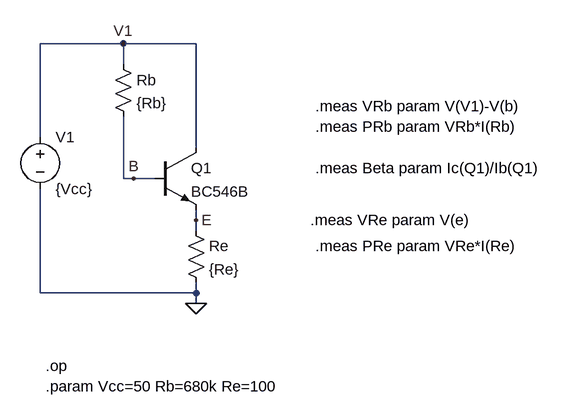
[diagram p0: schematic TBJ03a.asc]
TBJ03a.asc, the LTspice schematic file:
Version 4
SHEET 1 984 680
WIRE 256 -32 128 -32
WIRE 368 -32 256 -32
WIRE 256 0 256 -32
WIRE 128 112 128 -32
WIRE 368 128 368 -32
WIRE 256 176 256 80
WIRE 272 176 256 176
WIRE 304 176 272 176
WIRE 368 240 368 224
WIRE 368 256 368 240
WIRE 128 352 128 192
WIRE 368 352 368 336
WIRE 368 352 128 352
WIRE 368 368 368 352
FLAG 368 368 0
FLAG 272 176 B
FLAG 256 -32 V1
FLAG 368 240 E
SYMBOL voltage 128 96 R0
WINDOW 123 0 0 Left 0
WINDOW 39 0 0 Left 0
SYMATTR InstName V1
SYMATTR Value {Vcc}
SYMBOL res 240 -16 R0
SYMATTR InstName Rb
SYMATTR Value {Rb}
SYMBOL npn 304 128 R0
SYMATTR InstName Q1
SYMATTR Value BC546B
SYMBOL res 352 240 R0
SYMATTR InstName Re
SYMATTR Value {Re}
TEXT 136 464 Left 2 !.op
TEXT 136 496 Left 2 !.param Vcc=50 Rb=680k Re=100
TEXT 552 64 Left 2 !.meas VRb param V(V1)-V(b)
TEXT 552 96 Left 2 !.meas PRb param VRb*I(Rb)
TEXT 552 160 Left 2 !.meas Beta param Ic(Q1)/Ib(Q1)
TEXT 544 240 Left 2 !.meas VRe param V(e)
TEXT 552 280 Left 2 !.meas PRe param VRe*I(Re)

The netlist it stands for:
* TBJ03a.asc
V1 V1 0 {Vcc}
Rb V1 B {Rb}
Q1 V1 B E 0 BC546B
Re E 0 {Re}
.model NPN NPN
.model PNP PNP
.lib standard.bjt
.op
.param Vcc=50 Rb=680k Re=100
.meas VRb param V(V1)-V(b)
.meas PRb param VRb*I(Rb)
.meas Beta param Ic(Q1)/Ib(Q1)
.meas VRe param V(e)
.meas PRe param VRe*I(Re)
.backanno
.end